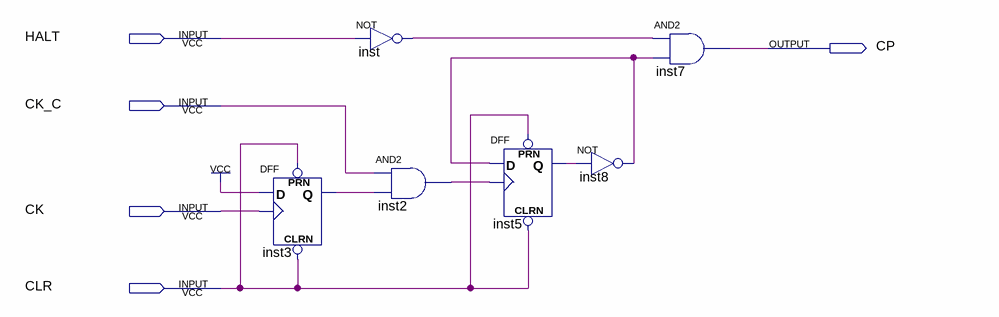
[diagram p0: schematic sheet]
// Quartus schematic start_circuit.bdf as structural Verilog: 6 symbols, 5 pins
module start_circuit (
  input  HALT,
  input  CK_C,
  input  CK,
  input  CLR,
  output CP
);

  wire inst2_out, inst3_q, inst5_q, inst8_out, inst_out;

  DFF inst3 (.CLRN(CLR), .CLK(CK), .D(1'b1), .PRN(CLR), .Q(inst3_q));
  not inst (inst_out, HALT);
  and inst2 (inst2_out, CK_C, inst3_q);
  DFF inst5 (.CLRN(CLR), .CLK(inst2_out), .D(inst8_out), .PRN(CLR), .Q(inst5_q));
  not inst8 (inst8_out, inst5_q);
  and inst7 (CP, inst_out, inst8_out);
endmodule
